# EAGLE design atmegademo (EAGLE 6.5.0)
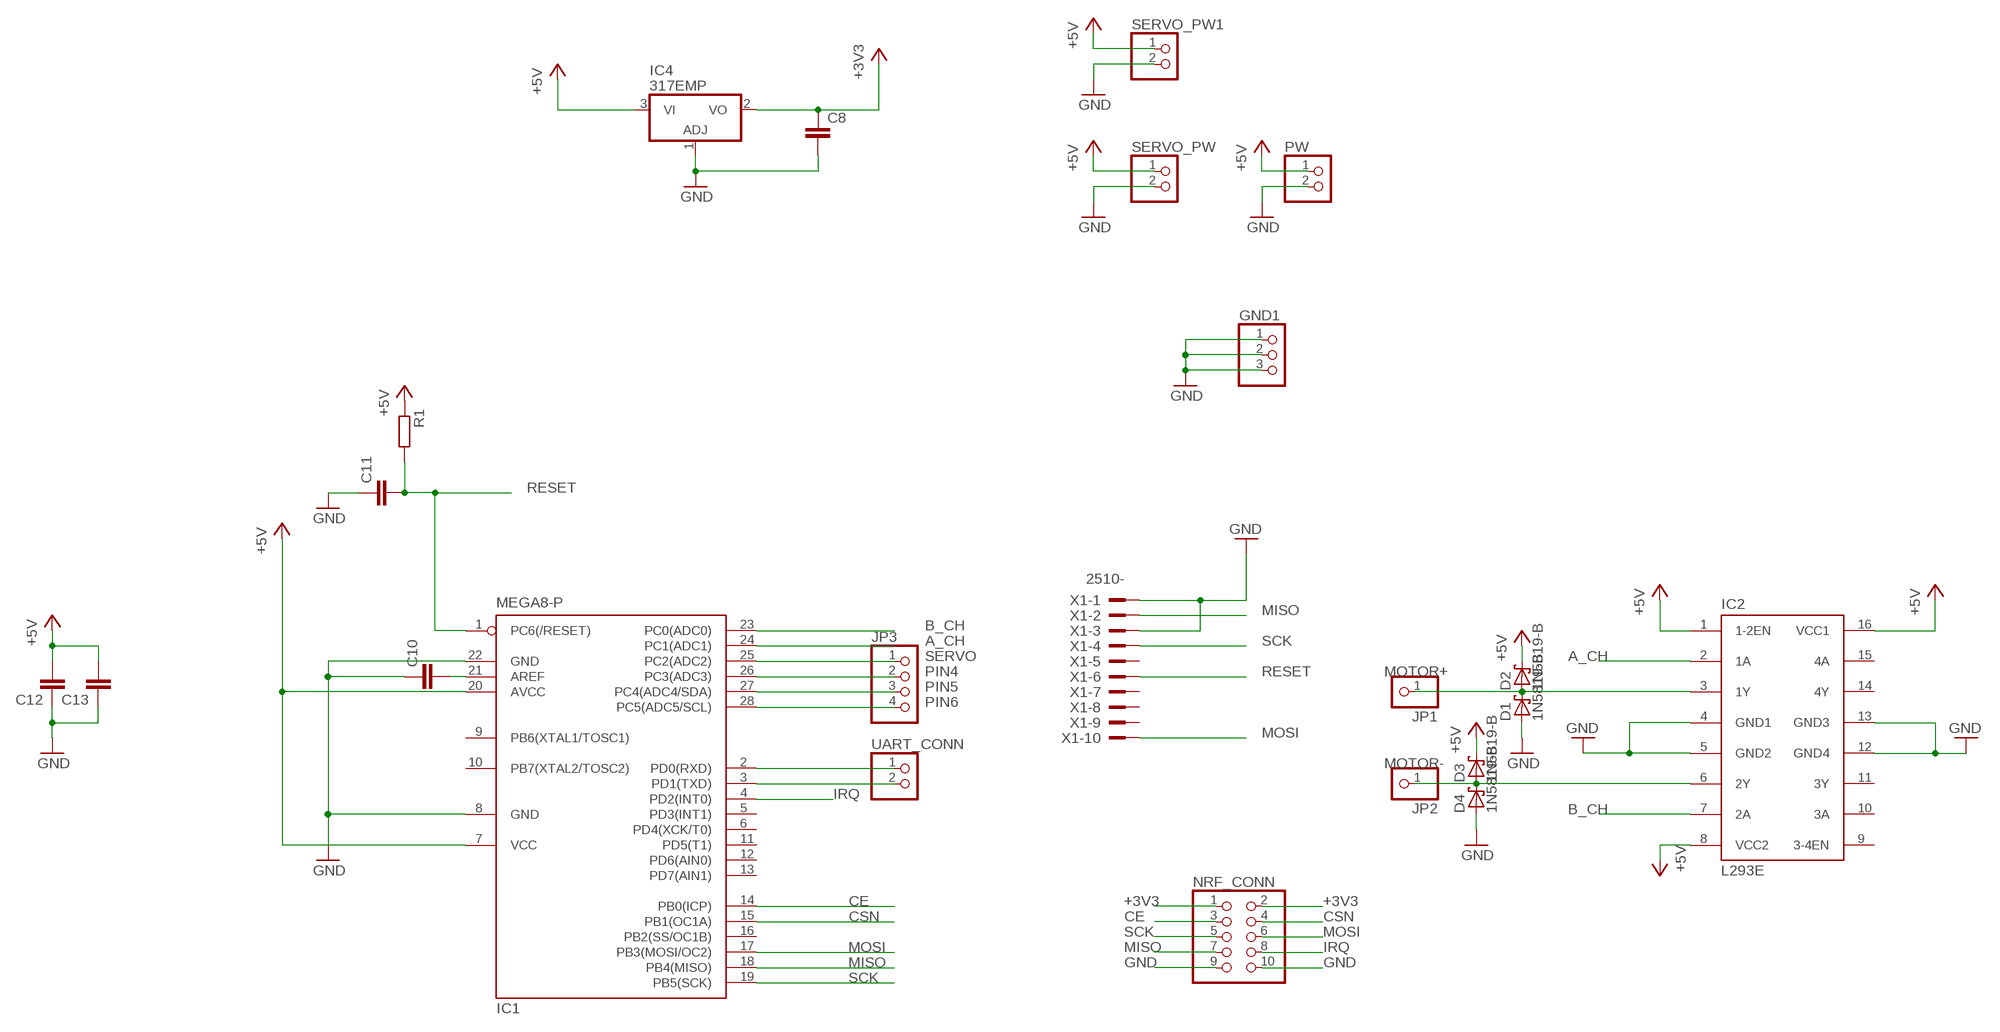
[diagram p0: schematic, sheet 1]

## Parts
C8  C-EUC0805K  [C0805K]
C10  C-EUC0805K  [C0805K]
C11  C-EUC0805K  [C0805K]
C12  C-EUC0805K  [C0805K]
C13  C-EUC0805K  [C0805K]
D1  1N5819-B  [DO41-7.6]
D2  1N5819-B  [DO41-7.6]
D3  1N5819-B  [DO41-7.6]
D4  1N5819-B  [DO41-7.6]
GND1  PINHD-1X3  [1X03]
IC1  MEGA8-P  [DIL28-3]
IC2  L293E  [DIL16]
IC4  317EMP  [SOT223]
JP1  PINHD-1X1  [1X01]
JP2  PINHD-1X1  [1X01]
JP3  PINHD-1X4  [1X04]
NRF_CONN  PINHD-2X5  [2X05]
PW  PINHD-1X2  [1X02]
R1  R-EU_0207/10  [0207/10]
SERVO_PW  PINHD-1X2  [1X02]
SERVO_PW1  PINHD-1X2  [1X02]
UART_CONN  PINHD-1X2  [1X02]
X1  2510-  [PAK100/2500-10]

## Nets
+3V3: C8.1 IC4.2(VO) NRF_CONN.1 NRF_CONN.2
+5V: C12.2 C13.2 D2.C D3.C IC1.7(VCC) IC1.20(AVCC) IC2.1(1-2EN) IC2.8(VCC2) IC2.16(VCC1) IC4.3(VI) PW.1 R1.1 SERVO_PW1.1 SERVO_PW.1
A_CH: IC1.24(PC1(ADC1)) IC2.2(1A)
B_CH: IC1.23(PC0(ADC0)) IC2.7(2A)
CE: IC1.14(PB0(ICP)) NRF_CONN.3
CSN: IC1.15(PB1(OC1A)) NRF_CONN.4
GND: C8.2 C10.1 C11.1 C12.1 C13.1 D1.A D4.A GND1.1 GND1.2 GND1.3 IC1.8(GND) IC1.22(GND) IC2.4(GND1) IC2.5(GND2) IC2.12(GND4) IC2.13(GND3) IC4.1(ADJ) NRF_CONN.9 NRF_CONN.10 PW.2 SERVO_PW1.2 SERVO_PW.2 X1.1 X1.3
IRQ: IC1.4(PD2(INT0)) NRF_CONN.8
MISO: IC1.18(PB4(MISO)) NRF_CONN.7 X1.2
MOSI: IC1.17(PB3(MOSI/OC2)) NRF_CONN.6 X1.10
MOTOR+: D1.C D2.A IC2.3(1Y) JP1.1
MOTOR-: D3.A D4.C IC2.6(2Y) JP2.1
N$1: IC1.2(PD0(RXD)) UART_CONN.1
N$2: IC1.3(PD1(TXD)) UART_CONN.2
N$26: C10.2 IC1.21(AREF)
PIN4: IC1.26(PC3(ADC3)) JP3.2
PIN5: IC1.27(PC4(ADC4/SDA)) JP3.3
PIN6: IC1.28(PC5(ADC5/SCL)) JP3.4
RESET: C11.2 IC1.1(PC6(/RESET)) R1.2 X1.6
SCK: IC1.19(PB5(SCK)) NRF_CONN.5 X1.4
SERVO: IC1.25(PC2(ADC2)) JP3.1
Unconnected: IC1.5(PD3(INT1)) IC1.6(PD4(XCK/T0)) IC1.9(PB6(XTAL1/TOSC1)) IC1.10(PB7(XTAL2/TOSC2)) IC1.11(PD5(T1)) IC1.12(PD6(AIN0)) IC1.13(PD7(AIN1)) IC1.16(PB2(SS/OC1B)) IC2.9(3-4EN) IC2.10(3A) IC2.11(3Y) IC2.14(4Y) IC2.15(4A) X1.5 X1.7 X1.8 X1.9

## Library data of the parts
C8 C10-C13 = resistor:C-EU: CAPACITOR, European symbol
D1-D4 = diode:1N581*: 1.0A SCHOTTKY BARRIER RECTIFIER Source: http://www.diodes.com/datasheets/ds23001.pdf
GND1 = adafruit:PINHD-1X3: PIN HEADER
IC1 = atmel:MEGA8-P: MICROCONTROLLER 8 Kbytes FLASH, 1 kbytes SRAM, 512 bytes EEPROM, USART, 4-channel 10 bit ADC, 2-channel 8 bit ADC Pin compatible with Atmega48, ATMega88, ATMega168 Source: avr.lbr; OC_FARNELL: unknown; OC_NEWARK: unknown
IC2 = texas:L293E: TI DEVICE; MF: Arrow Electronics; MPN: L293E; OC_FARNELL: 1467711; OC_NEWARK: 89K0732
IC4 = linear:*317: Positive VOLTAGE REGULATOR
JP1 JP2 = pinhead:PINHD-1X1: PIN HEADER
JP3 = pinhead:PINHD-1X4: PIN HEADER
NRF_CONN = pinhead:PINHD-2X5: PIN HEADER
PW SERVO_PW SERVO_PW1 UART_CONN = pinhead:PINHD-1X2: PIN HEADER
R1 = resistor:R-EU_: RESISTOR, European symbol
X1 = con-3m:2510-: 3M (TM) Pak 100 4-Wall Header Source: 3M; MF: 3M; MPN: 2510-6002UB; OC_FARNELL: 9838244; OC_NEWARK: 46F4725

## Net classes
0 default: clearance 0.355 mm

## Board
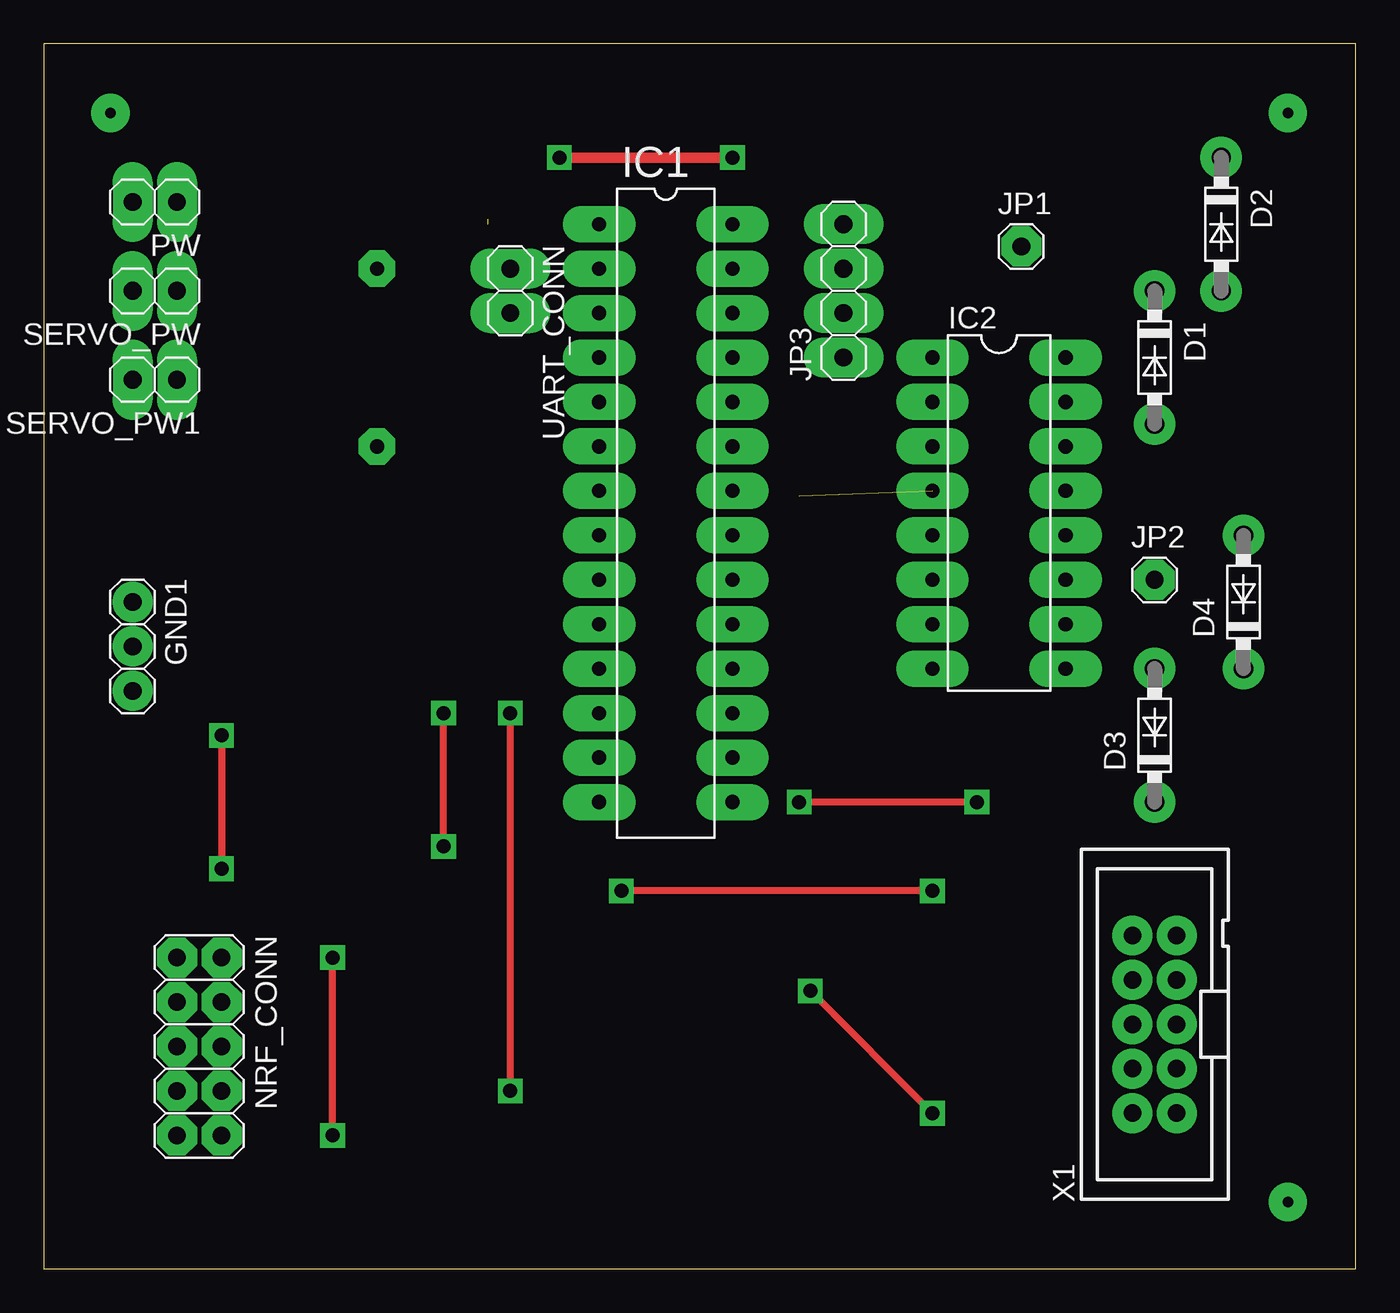
[diagram p1: board, top side]
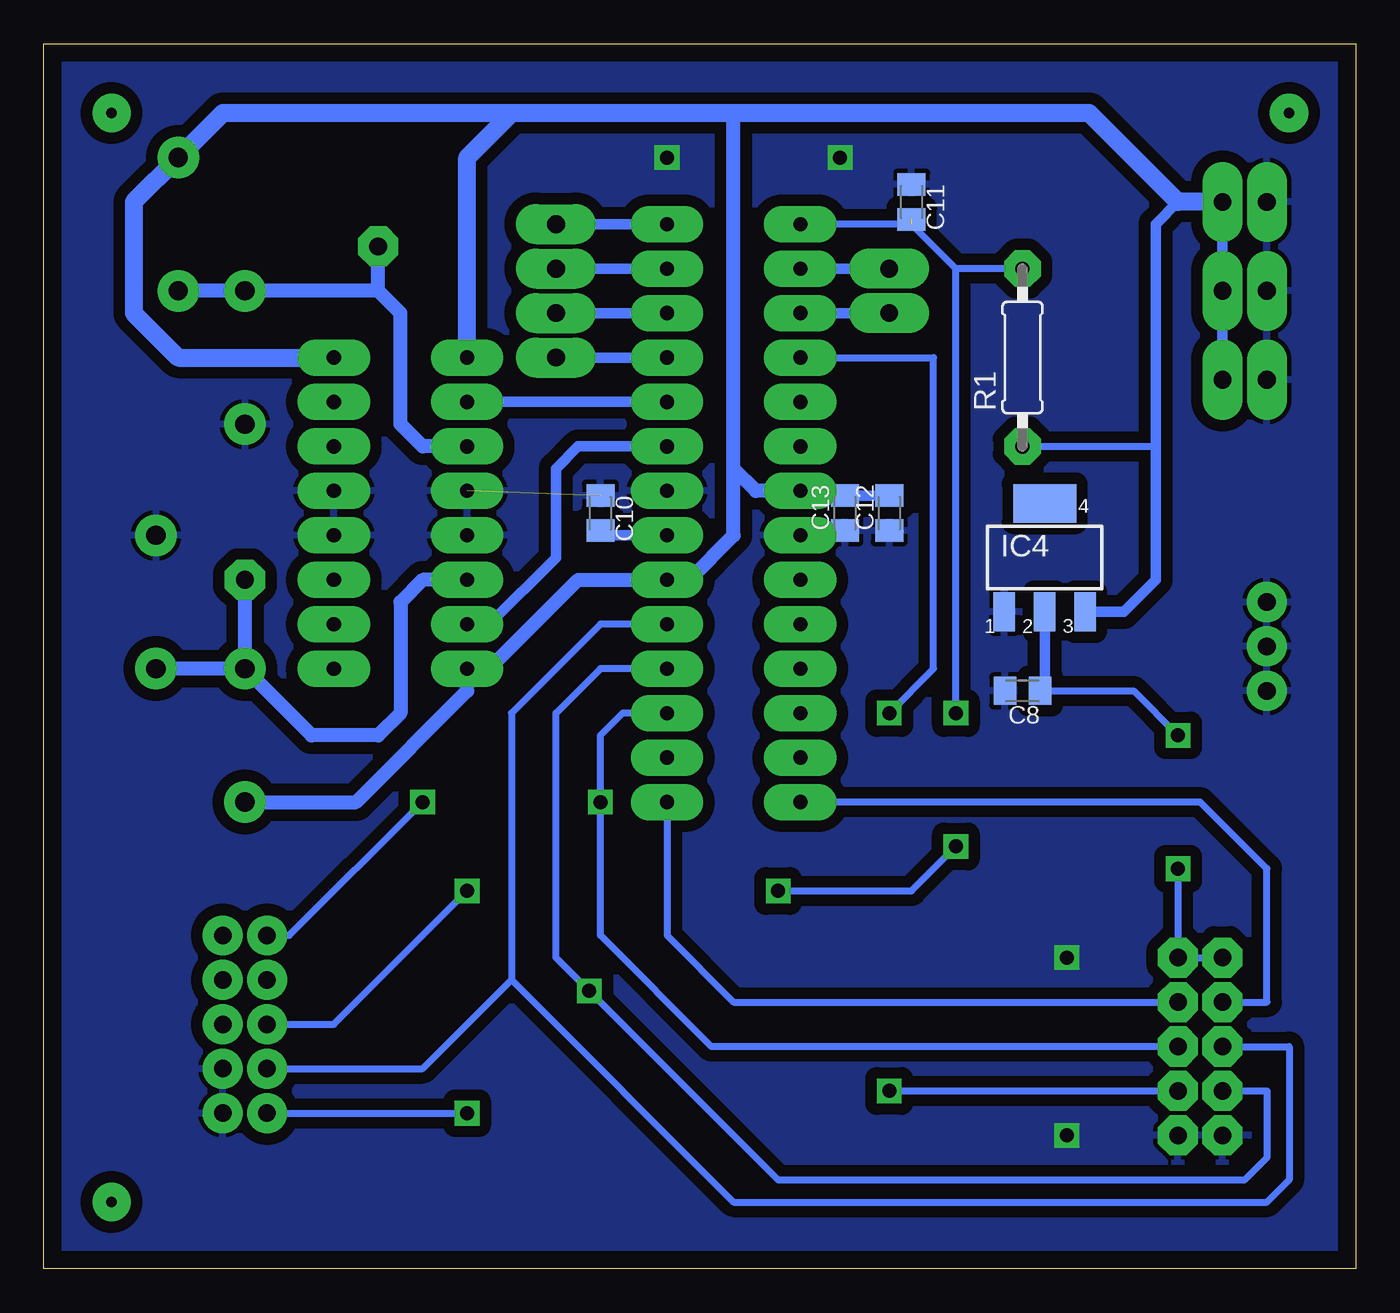
[diagram p2: board, bottom side, seen from below]

Size 75 x 70 mm. Coordinates in mm from the lower left corner, seen from the top.
Outline: 0,0 75,0 75,70 0,70 0,0
Copper layers (1*16): Top 0.035mm / dielectric 1.5mm / Bottom 0.035mm
Design rules "default": minimum track width 10mil, minimum drill 32mil, track to track 12mil, track to pad 12mil, pad to pad 12mil, via to via 12mil, smd to smd 8mil, copper to edge 40mil, drill to drill 40mil, minimum pad ring 25mil, minimum via ring 12mil, stop-mask expansion 4mil, vias tented up to drill 0mil, thermal gap 10mil
tRestrict: area 5.1,4.5 to 40.6,20.3

### Footprints (pad centres in the part's own frame; a part is rotated, then mirrored left to right if it is on the bottom)
C0805K = smd 1.3 x 1.6: 1 -1,0; 2 1,0
DO41-7.6 = drill 1.1 pad 1.7: A 3.81,0; C -3.81,0
1X03 = drill 1.016: 1 -2.54,0; 2 0,0; 3 2.54,0
DIL28-3 = drill 0.813 long: 1 -16.51,-3.81; 2 -13.97,-3.81; 3 -11.43,-3.81; 4 -8.89,-3.81; 5 -6.35,-3.81; 6 -3.81,-3.81; 7 -1.27,-3.81; 8 1.27,-3.81; 9 3.81,-3.81; 10 6.35,-3.81; 11 8.89,-3.81; 12 11.43,-3.81; 13 13.97,-3.81; 14 16.51,-3.81; 15 16.51,3.81; 16 13.97,3.81; 17 11.43,3.81; 18 8.89,3.81; 19 6.35,3.81; 20 3.81,3.81; 21 1.27,3.81; 22 -1.27,3.81; 23 -3.81,3.81; 24 -6.35,3.81; 25 -8.89,3.81; 26 -11.43,3.81; 27 -13.97,3.81; 28 -16.51,3.81
DIL16 = drill 0.813 long: 1 -8.89,-3.81; 2 -6.35,-3.81; 3 -3.81,-3.81; 4 -1.27,-3.81; 5 1.27,-3.81; 6 3.81,-3.81; 7 6.35,-3.81; 8 8.89,-3.81; 9 8.89,3.81; 10 6.35,3.81; 11 3.81,3.81; 12 1.27,3.81; 13 -1.27,3.81; 14 -3.81,3.81; 15 -6.35,3.81; 16 -8.89,3.81
SOT223 = smd 1.219 x 2.235: 1 -2.311,-3.099; 2 0,-3.099; 3 2.311,-3.099 | smd 3.6 x 2.2: 4 0,3.099
1X01 = drill 1.016 octagon: 1 0,0
1X04 = drill 1.016 long: 1 -3.81,0; 2 -1.27,0; 3 1.27,0; 4 3.81,0
2X05 = drill 1.016 octagon: 1 -5.08,-1.27; 2 -5.08,1.27; 3 -2.54,-1.27; 4 -2.54,1.27; 5 0,-1.27; 6 0,1.27; 7 2.54,-1.27; 8 2.54,1.27; 9 5.08,-1.27; 10 5.08,1.27
1X02 = drill 1.016 long: 1 -1.27,0; 2 1.27,0
0207/10 = drill 0.813 octagon: 1 -5.08,0; 2 5.08,0
PAK100/2500-10 = drill 1 pad 1.422: 1 -5.08,-1.27; 2 -5.08,1.27; 3 -2.54,-1.27; 4 -2.54,1.27; 5 0,-1.27; 6 0,1.27; 7 2.54,-1.27; 8 2.54,1.27; 9 5.08,-1.27; 10 5.08,1.27

### Placement (x,y rotation side)
C8  19.05,33.02 180 bottom
C10  43.18,43.18 270 bottom
C11  25.4,60.96 270 bottom
C12  26.67,43.18 90 bottom
C13  29.21,43.18 90 bottom
D1  63.5,52.07 270 top
D2  67.31,59.69 270 top
D3  63.5,30.48 90 top
D4  68.58,38.1 90 top
GND1  5.08,35.56 270 top
IC1  35.56,43.18 270 top
IC2  54.61,43.18 270 top
IC4  17.78,40.64 0 bottom
JP1  55.88,58.42 0 top
JP2  63.5,39.37 0 top
JP3  45.72,55.88 90 top
NRF_CONN  8.89,12.7 270 top
PW  6.35,60.96 180 top
R1  19.05,52.07 90 bottom
SERVO_PW  6.35,55.88 180 top
SERVO_PW1  6.35,50.8 180 top
UART_CONN  26.67,55.88 270 top
X1  63.5,13.97 90 top

### Tracks (layer width: path | path; a pad name or v marks a point on that pad's centre or on a via)
+3V3  (via drill 0.8)
  Top 0.406: v10.16,30.48 v10.16,22.86
  Bottom 0.406: 17.78,33.02 12.7,33.02 v10.16,30.48 | v10.16,22.86 NRF_CONN.2 NRF_CONN.1
  Bottom 0.61: C8.1 17.78,33.02 IC4.2
+5V
  Bottom 0.406: R1.1 11.43,46.99
  Bottom 0.61: IC1.20 38.1,39.37 | IC4.3 13.26,37.54 11.43,39.37 11.43,46.99 11.43,59.69 10.16,60.96 | IC1.7 29.48,44.45 C13.2 C12.2 | PW.1 SERVO_PW.1 SERVO_PW1.1
  Bottom 0.813: D3.C 57.15,26.67 50.8,33.02 IC2.8 49.53,34.29 44.45,39.37 IC1.20 | 38.1,39.37 35.56,41.91 35.56,45.72 | 35.56,45.72 35.56,66.04 | IC1.7 34.29,44.45 35.56,45.72
  Bottom 1.016: PW.1 10.16,60.96 15.24,66.04 35.56,66.04 48.26,66.04 | 48.26,66.04 64.77,66.04 D2.C 69.85,60.96 69.85,54.61 67.31,52.07 IC2.16 | IC2.1 50.8,63.5 48.26,66.04
A_CH
  Bottom 0.61: IC1.24 IC2.2
B_CH
  Bottom 0.406: IC2.7 49.53,36.83
  Bottom 0.61: 49.53,36.83 45.72,40.64 45.72,45.72 44.45,46.99 IC1.23
CE
  Bottom 0.406: IC1.14 8.89,26.67 5.08,22.86 5.08,15.24 NRF_CONN.3
CSN
  Bottom 0.406: IC1.15 39.37,19.05 35.56,15.24 NRF_CONN.4
GND  (via drill 0.8)  (1 unrouted)
  Top 0.406: v16.51,7.62 v16.51,17.78
  Top 0.61: v39.37,63.5 v29.48,63.5
  Bottom 0.406: IC1.8 29.21,41.91 C13.1
  pour Bottom (isolate 0.66): -2.54,72.39 77.47,72.39 77.47,-2.54 -2.54,-2.54
IRQ  (via drill 0.8, 0.8 pad 0.81)
  Top 0.406: v26.67,31.75 v26.67,10.16
  Bottom 0.406: IC1.4 24.13,52.07 24.13,34.29 v26.67,31.75 | v26.67,10.16 NRF_CONN.8
MISO  (via drill 0.8)
  Top 0.406: v50.8,8.89 v43.81,15.88
  Bottom 0.406: NRF_CONN.7 5.08,10.16 5.08,6.35 6.35,5.08 33.02,5.08 v43.81,15.88 45.72,17.78 45.72,31.75 43.18,34.29 IC1.18 | X1.2 v50.8,8.89
MOSI  (via drill 0.8)
  Top 0.406: v53.34,26.67 v43.18,26.67
  Bottom 0.406: NRF_CONN.6 36.83,12.7 43.18,19.05 v43.18,26.67 43.18,30.48 41.91,31.75 IC1.17 | X1.10 60.96,19.05 v53.34,26.67
MOTOR+
  Bottom 0.813: IC2.3 53.34,46.99 54.61,48.26 54.61,54.61 55.88,55.88 | 55.88,55.88 D1.C D2.A | 55.88,55.88 JP1.1
MOTOR-
  Bottom 0.813: IC2.6 53.34,39.37 54.61,38.1 54.61,31.75 55.88,30.48 59.69,30.48 D3.A | D3.A D4.C | D3.A JP2.1
N$1
  Bottom 0.61: UART_CONN.1 IC1.2
N$2
  Bottom 0.61: UART_CONN.2 IC1.3
N$3  (via drill 0.6 pad 2.18)
  other vias: 3.81,66.04
N$4  (via drill 0.6 pad 2.18)
  other vias: 71.12,66.04
N$5  (via drill 0.6 pad 2.18)
  other vias: 71.12,3.81
N$26
  Bottom 0.61: IC1.21 42.91,41.91 C10.2
PIN4
  Bottom 0.61: IC1.26 JP3.2
PIN5
  Bottom 0.61: IC1.27 JP3.3
PIN6
  Bottom 0.61: IC1.28 JP3.4
RESET  (via drill 0.8, 0.8 pad 0.81)  (1 unrouted)
  Top 0.406: v50.8,21.59 v33.02,21.59 | v22.86,24.13 v22.86,31.75
  Bottom 0.406: X1.6 58.42,13.97 v50.8,21.59 | v33.02,21.59 25.4,21.59 v22.86,24.13 | 22.86,57.15 25.4,59.69 IC1.1 | v22.86,31.75 22.86,57.15 | R1.2 22.86,57.15
SCK
  Bottom 0.406: 48.26,16.51 48.26,31.75 43.18,36.83 IC1.19 | X1.4 53.34,11.43 48.26,16.51 | 48.26,16.51 35.56,3.81 5.08,3.81 3.81,5.08 3.81,12.7 NRF_CONN.5
SERVO
  Bottom 0.61: IC1.25 JP3.1

### Text on the board
bRestrict: 09/2013 | Chinnoff Bros.